# Altium project backplaneIGVC.PrjPcb
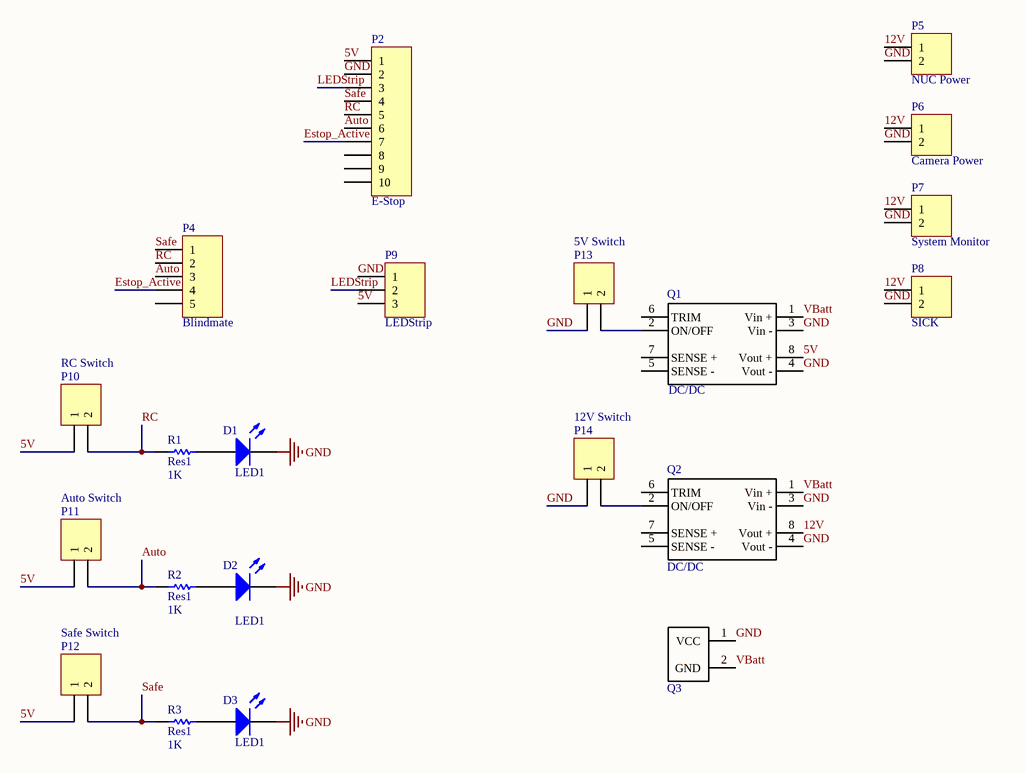
[diagram p0: backplaneIGVC.SchDoc]
1 sheet, 21 parts. Net scope: global (net labels, ports and power ports of the same name join across sheets).
Board file: backplaneIGVC.PcbDoc

## Sheet backplaneIGVC.SchDoc
size A

### Parts
D1  LED1  [LED-1]
D2  LED1  [LED-1]
D3  LED1  [LED-1]
P2  E-Stop  [HDR1X10]
P4  Blindmate  [HDR1X5]
P5  NUC Power  [HDR1X2]
P6  Camera Power  [HDR1X2]
P7  System Monitor  [HDR1X2]
P8  SICK  [HDR1X2]
P9  LEDStrip  [HDR1X3]
P10  RC Switch  [HDR1X2]
P11  Auto Switch  [HDR1X2]
P12  Safe Switch  [HDR1X2]
P13  5V Switch  [HDR1X2]
P14  12V Switch  [HDR1X2]
Q1  DC/DC  [EHHD]
Q2  DC/DC  [EHHD]
Q3  Power Conn  [Mini-Fit Power Conn]  (value not drawn)
R1  Res1  value 1K  [AXIAL-0.3]
R2  Res1  value 1K  [AXIAL-0.3]
R3  Res1  value 1K  [AXIAL-0.3]

### Nets
GND: D1.2(K) D2.2(K) D3.2(K) P2.2 P5.2 P6.2 P7.2 P8.2 P9.1 P13.1 P14.1 Q1.3(Vin_-) Q1.4(Vout_-) Q2.3(Vin_-) Q2.4(Vout_-) Q3.1(VCC)
5V: P2.1 P9.3 P10.1 P11.1 P12.1 Q1.8(Vout_+)
12V: P5.1 P6.1 P7.1 P8.1 Q2.8(Vout_+)
Auto: P2.6 P4.3 P11.2 R2.1
Estop_Active: P2.7 P4.4
LEDStrip: P2.3 P9.2
RC: P2.5 P4.2 P10.2 R1.1
Safe: P2.4 P4.1 P12.2 R3.1
VBatt: Q1.1(Vin_+) Q2.1(Vin_+) Q3.2(GND)
NetD1_1: D1.1(A) R1.2
NetD2_1: D2.1(A) R2.2
NetD3_1: D3.1(A) R3.2
NetP13_2: P13.2 Q1.2(ON/OFF)
NetP14_2: P14.2 Q2.2(ON/OFF)

Not connected (* = marked no-connect by the designer): P2 8 9 10; P4 5; Q1 5(SENSE_-) 6(TRIM) 7(SENSE_+); Q2 5(SENSE_-) 6(TRIM) 7(SENSE_+)

### Library data of the parts
D1-D3 = LED1: Typical RED GaAs LED; Published: 8-Jun-2000; LatestRevisionDate: 08-Jul-2005; LatestRevisionNote: Mech Layer 1 removed.; PackageReference: LED-1; Publisher: Altium Limited; PackageDescription: LED; 2 Leads
P2 = Header 10: Header, 10-Pin; LatestRevisionDate: 17-Jul-2002; LatestRevisionNote: Re-released for DXP Platform.; Publisher: Altium Limited
P4 = Header 5: Header, 5-Pin; LatestRevisionDate: 17-Jul-2002; LatestRevisionNote: Re-released for DXP Platform.; Publisher: Altium Limited
P5-P8 P10-P14 = Header 2: Header, 2-Pin; LatestRevisionDate: 17-Jul-2002; LatestRevisionNote: Re-released for DXP Platform.; Publisher: Altium Limited
P9 = Header 3: Header, 3-Pin; LatestRevisionDate: 17-Jul-2002; LatestRevisionNote: Re-released for DXP Platform.; Publisher: Altium Limited
Q1 Q2 = EHHD: Voltage Regulator
Q3 = Mini-Fit Power Conn: Mini-Fit Molex Connector
R1-R3 = Res1: Resistor; Published: 8-Jun-2000; LatestRevisionDate: 17-Jul-2002; LatestRevisionNote: Re-released for DXP Platform.; PackageReference: AXIAL-0.3; Publisher: Altium Limited; PackageDescription: Axial Device, Thru-Hole; 2 Leads; 0.3 in Pin Spacing